# EAGLE design rcstick-jig (EAGLE 9.3.0)
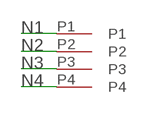
[diagram p0: schematic, sheet 1]

## Parts
U$1  4PAD  [4PAD]

## Nets
N1: U$1.P1
N2: U$1.P2
N3: U$1.P3
N4: U$1.P4

## Library data of the parts
U$1 = testpad:4PAD

## Board
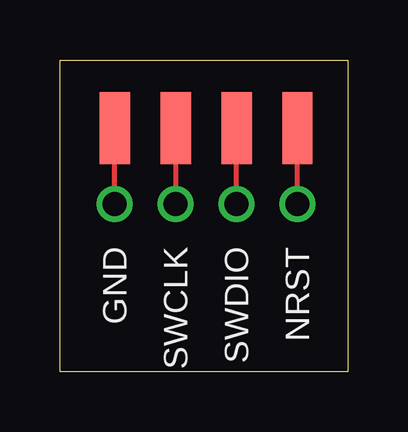
[diagram p1: board, top side]

Size 12 x 13 mm. Coordinates in mm from the lower left corner, seen from the top.
Outline: 0,0 0,13 12,13 12,0 0,0
Copper layers (1*16): Top 0.035mm / dielectric 1.6mm / Bottom 0.035mm
Design rules "Elecrow_2-layer_PCB_eagle_rule": minimum track width 6mil, minimum drill 12mil, track to track 6mil, track to pad 6mil, pad to pad 6mil, via to via 8mil, smd to smd 0mil, copper to edge 20mil, drill to drill 10mil, minimum pad ring 6mil, minimum via ring 6mil, stop-mask expansion 0mil, vias tented up to drill 100mil, thermal gap 10mil

### Footprints (pad centres in the part's own frame; a part is rotated, then mirrored left to right if it is on the bottom)
4PAD = smd 1.27 x 3: P1 -3.81,0; P2 -1.27,0; P3 1.27,0; P4 3.81,0

### Placement (x,y rotation side)
U$1  6.1,10.16 0 top

### Tracks (layer width: path | path; a pad name or v marks a point on that pad's centre or on a via)
N1  (via drill 1)
  Top 0.2: v2.29,6.99 U$1.P1
N2  (via drill 1)
  Top 0.2: U$1.P2 v4.83,6.99
N3  (via drill 1)
  Top 0.2: v7.37,6.99 U$1.P3
N4  (via drill 1)
  Top 0.2: v9.91,6.99 U$1.P4

### Text on the board
tPlace: GND | SWCLK | SWDIO | NRST